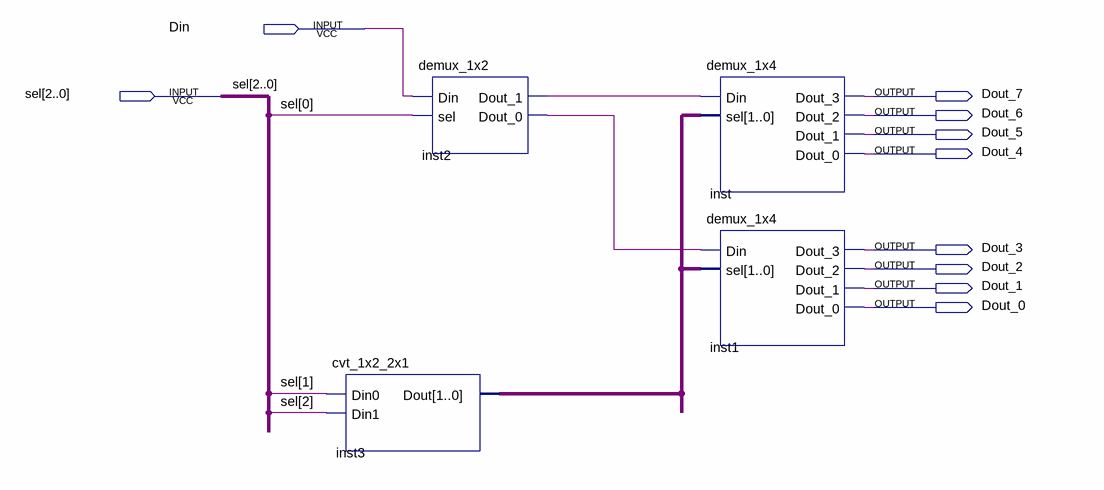
[diagram p0: schematic sheet]
// Quartus schematic demux_1x8.bdf as structural Verilog: 4 symbols, 10 pins
module demux_1x8 (
  input  Din,
  input  [2:0] sel,
  output Dout_7,
  output Dout_6,
  output Dout_5,
  output Dout_4,
  output Dout_3,
  output Dout_2,
  output Dout_1,
  output Dout_0
);

  wire inst2_dout_0, inst2_dout_1;
  wire [1:0] inst3_dout;

  cvt_1x2_2x1 inst3 (.Din0(sel[1]), .Din1(sel[2]), .Dout(inst3_dout));
  demux_1x2 inst2 (.Din(Din), .sel(sel[0]), .Dout_1(inst2_dout_1), .Dout_0(inst2_dout_0));
  demux_1x4 inst (
    .Din(inst2_dout_1), .sel(inst3_dout), .Dout_3(Dout_7), .Dout_2(Dout_6), .Dout_1(Dout_5), .Dout_0(Dout_4));
  demux_1x4 inst1 (
    .Din(inst2_dout_0), .sel(inst3_dout), .Dout_3(Dout_3), .Dout_2(Dout_2), .Dout_1(Dout_1), .Dout_0(Dout_0));
endmodule
